# Altium schematic sheet SerialPort.SchDoc
size A
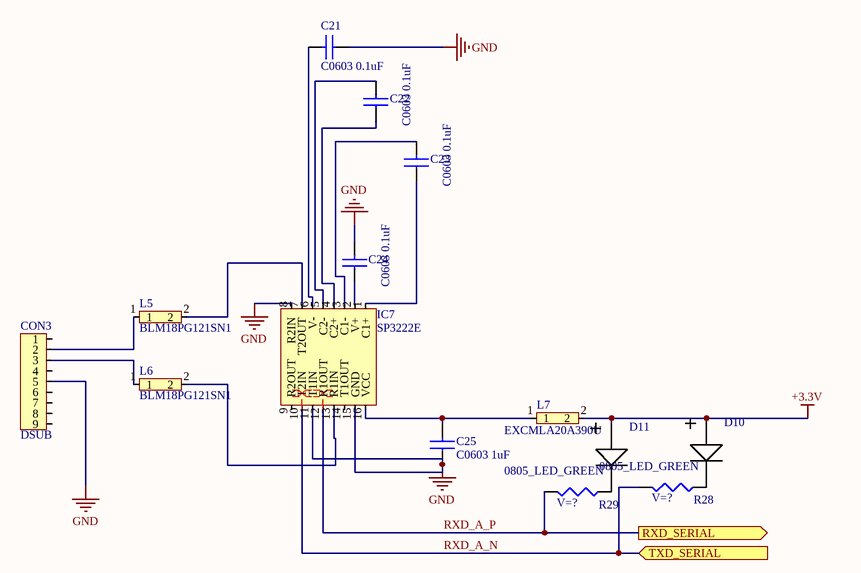
[diagram p0: SerialPort.SchDoc]

## Parts
C21  C0603 0.1uF  [C0603]
C22  C0603 0.1uF  [C0603]
C23  C0603 0.1uF  [C0603]
C24  C0603 0.1uF  [C0603]
C25  C0603 1uF  [C0603]
CON3  DSUB  [DSUB]
D10  0805_LED_GREEN  [0805LED_GREEN]
D11  0805_LED_GREEN  [0805LED_GREEN]
IC7  SP3222E  [SSOP16]
L5  BLM18PG121SN1  [C0603]
L6  BLM18PG121SN1  [C0603]
L7  EXCMLA20A390U  [L0805]
R28  V=?  [r0402]
R29  V=?  [r0402]

## Ports
RXD_SERIAL (out), TXD_SERIAL (in)

## Nets
+3.3V: D10.2 D11.2 L7.2
GND: C21.1 C24.2 C25.1 CON3.5 IC7.8(R2IN) IC7.11(T1IN) IC7.15(GND)
RXD_A_N: IC7.10(T2IN) R28.2 ; port TXD_SERIAL
RXD_A_P: IC7.12(R1OUT) R29.2 ; port RXD_SERIAL
NetC21_2: C21.2 IC7.6(V-)
NetC22_1: C22.1 IC7.4(C2+)
NetC22_2: C22.2 IC7.5(C2-)
NetC23_1: C23.1 IC7.1(C1+)
NetC23_2: C23.2 IC7.3(C1-)
NetC24_1: C24.1 IC7.2(V+)
NetC25_2: C25.2 IC7.16(VCC) L7.1
NetCON3_2: CON3.2 L5.1
NetCON3_3: CON3.3 L6.1
NetD10_1: D10.1 R28.1
NetD11_1: D11.1 R29.1
NetIC7_7: IC7.7(T2OUT) L5.2
NetIC7_13: IC7.13(R1IN) L6.2

Not connected (* = marked no-connect by the designer): CON3 1 4 6 7 8 9; IC7 9(R2OUT) 14(T1OUT)

## Layout directives
differential pair; rule Differential Pairs Routing [Pref Gap = 6mil    Min Gap  = 6mil    Max Gap  = 6milPref Width = 9.5mil    Min Width  = 9.5mil    Max Width  = 9.5mil]: RXD_A_N, RXD_A_P

## Library data of the parts
C21-C24 = C0603 0.1uF: CAP CER 0.1uF 16V X7R 0603 / CL10B104K08NNNC
C25 = C0603 1uF: CAP CER 1uF 10V X7R 0603
CON3 = DSUB: 1734354 - DSUB
D10 D11 = 0805_LED_GREEN: LGR971-KN OSRAM
IC7 = SP3222E: IC TXRX RS232 ESD TRUE 16SSOP
L5 L6 = BLM18PG121SN1: FERRITE BEAD 120OHM 2A
L7 = EXCMLA20A390U: FERRITE BEAD 39 OHM
R28 R29 = R0402: RESISTOR